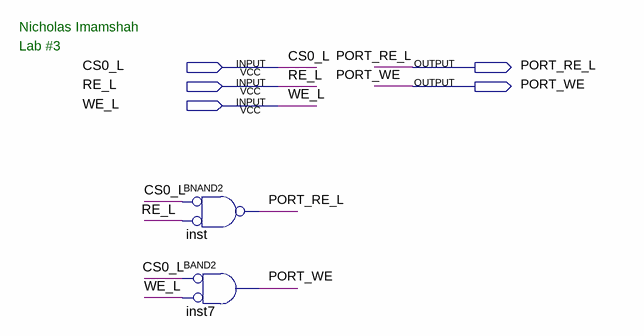
[diagram p0: schematic sheet]
// Quartus schematic cpld_config.bdf as structural Verilog: 2 symbols, 5 pins
module cpld_config (
  input  CS0_L,
  input  RE_L,
  input  WE_L,
  output PORT_RE_L,
  output PORT_WE
);

  nand inst (PORT_RE_L, ~CS0_L, ~RE_L);  // BNAND2
  and inst7 (PORT_WE, ~CS0_L, ~WE_L);  // BAND2

  // Notes on the sheet:
  //   Nicholas Imamshah
  //   Lab #3
endmodule
